# Altium schematic sheet 19 PCIE.SchDoc: CM4 IO
size 297 x 209 mm; Page Create Date: March  8, 1995; Page Number: 19; Page Size: A4; Comment: radxa_1010; Page Count: 19; RevCode: V1.10; Doc: 19 PCIE; DsnPath: D:\WMS\黄工\[RC126]CM4_IO_V1.10\[RC126]_V1.10\CM4 IO_V1.10.DSN; SchematicName: CM4 IO V1.10; PageName: 19 PCIE; PageSize: A4; TopSchematic: True
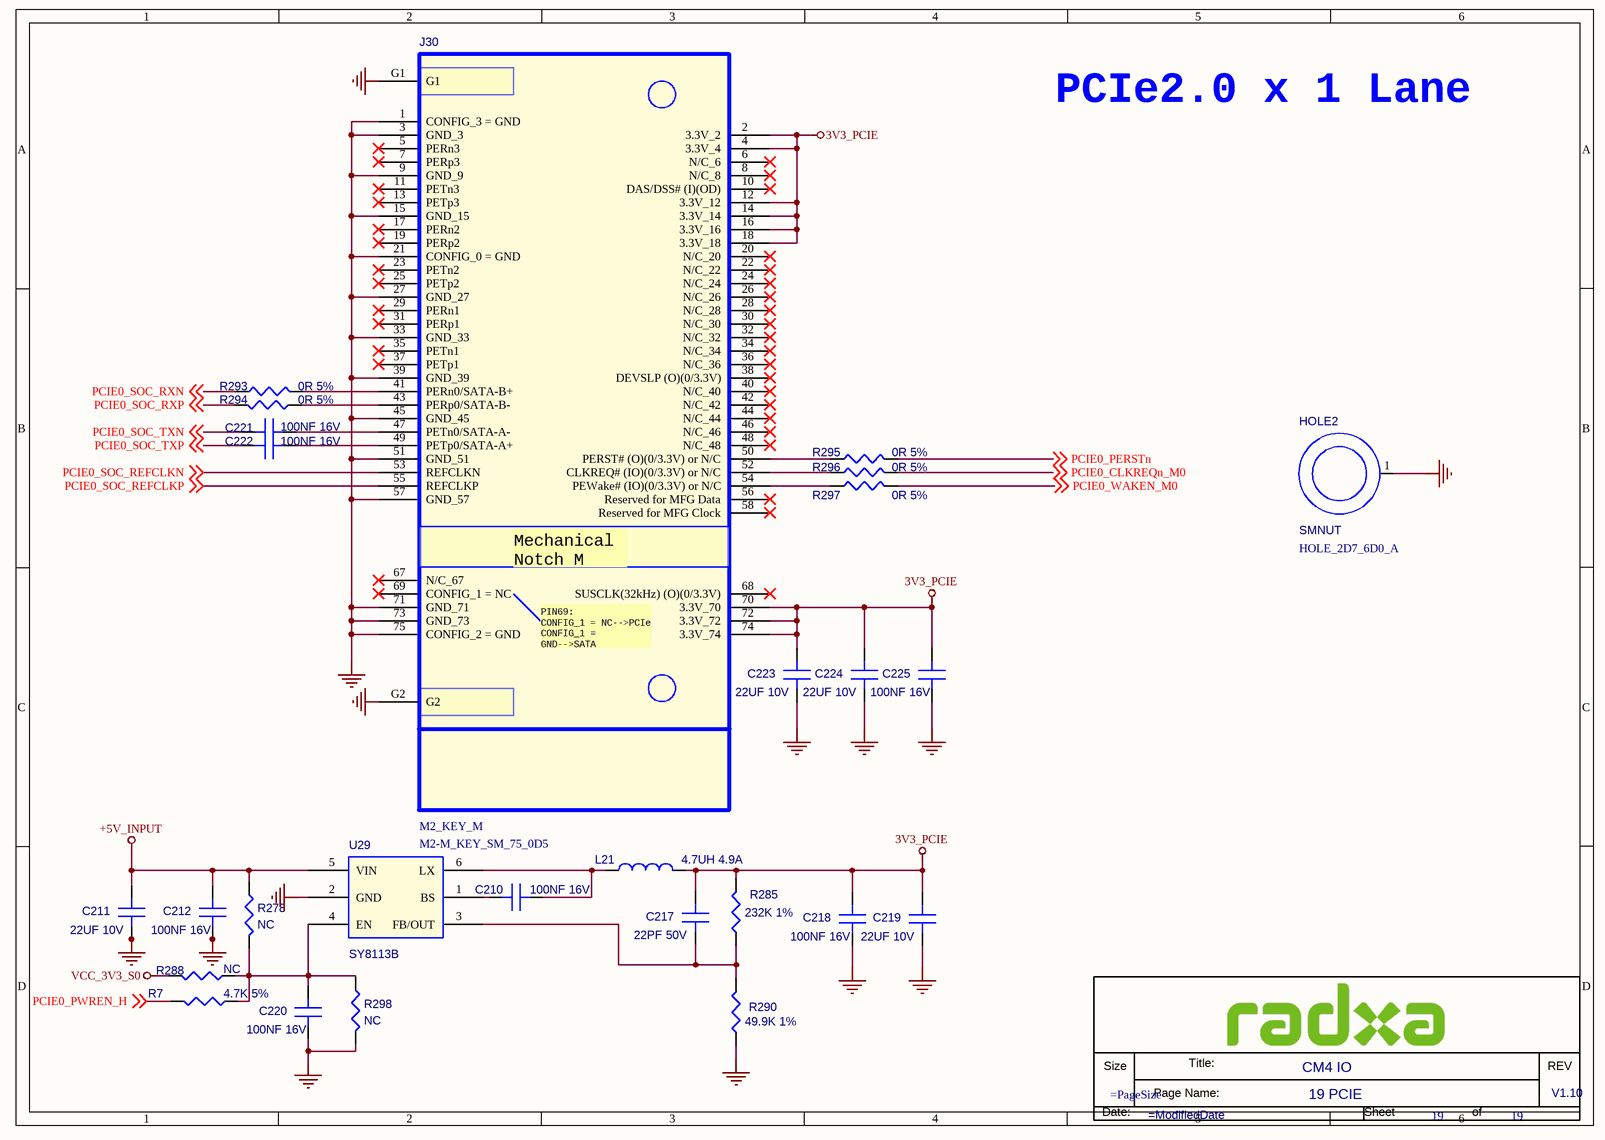
[diagram p0: 19 PCIE.SchDoc]

## Parts
*  Doc: 19 PCIE  RevCode: V1.10  Title: CM4 IO  Page Number: 19  (hidden comment: radxa_1010)  (graphical)
C210  100NF 16V  [C0201]
C211  22UF 10V  [C0603]
C212  100NF 16V  [C0201]
C217  22PF 50V  [C0201]
C218  100NF 16V  [C0201]
C219  22UF 10V  [C0603]
C220  100NF 16V  [C0201]
C221  100NF 16V  [C0201]
C222  100NF 16V  [C0201]
C223  22UF 10V  [C0603]
C224  22UF 10V  [C0603]
C225  100NF 16V  [C0201]
HOLE2  SMNUT  [HOLE_2D7_6D0_A]
J30  M2_KEY_M  [M2-M_KEY_SM_75_0D5]
L21  4.7UH 4.9A  [L_4020]
R7  4.7K 5%  [R0402]
R278  NC  [R0402]
R285  232K 1%  [R0402]
R288  NC  [R0402]
R290  49.9K 1%  [R0402]
R293  0R 5%  [R0402]
R294  0R 5%  [R0402]
R295  0R 5%  [R0402]
R296  0R 5%  [R0402]
R297  0R 5%  [R0402]
R298  NC  [R0402]
U29  SY8113B  [SOT23_6]

## Nets
3V3_PCIE: C217.1(A) C218.1(A) C219.1(A) C223.1(A) C224.1(A) C225.1(A) J30.2(3.3V_2) J30.4(3.3V_4) J30.12(3.3V_12) J30.14(3.3V_14) J30.16(3.3V_16) J30.18(3.3V_18) J30.70(3.3V_70) J30.72(3.3V_72) J30.74(3.3V_74) L21.2 R285.1
+5V_INPUT: C211.1(A) C212.1(A) R278.2 U29.5(VIN)
GND: C211.2(B) C212.2(B) C218.2(B) C219.2(B) C220.2(B) C223.2(B) C224.2(B) C225.2(B) HOLE2.1 J30.1(CONFIG_3_=_GND) J30.3(GND_3) J30.9(GND_9) J30.15(GND_15) J30.21(CONFIG_0_=_GND) J30.27(GND_27) J30.33(GND_33) J30.39(GND_39) J30.45(GND_45) J30.51(GND_51) J30.57(GND_57) J30.71(GND_71) J30.73(GND_73) J30.75(CONFIG_2_=_GND) J30.G1 J30.G2 R290.2 R298.1 U29.2(GND)
VCC_3V3_S0: R288.1
PCIE0_CLKREQn_M0: R296.2 ; off-sheet PCIE0_CLKREQn_M0
PCIE0_PERSTn: R295.2 ; off-sheet PCIE0_PERSTn
PCIE0_PWREN_H: R7.1 ; off-sheet PCIE0_PWREN_H
PCIE0_SOC_REFCLKN: J30.53(REFCLKN) ; off-sheet PCIE0_SOC_REFCLKN
PCIE0_SOC_REFCLKP: J30.55(REFCLKP) ; off-sheet PCIE0_SOC_REFCLKP
PCIE0_SOC_RXN: R293.1 ; off-sheet PCIE0_SOC_RXN
PCIE0_SOC_RXP: R294.1 ; off-sheet PCIE0_SOC_RXP
PCIE0_SOC_TXN: C221.1(A) ; off-sheet PCIE0_SOC_TXN
PCIE0_SOC_TXP: C222.1(A) ; off-sheet PCIE0_SOC_TXP
PCIE0_WAKEN_M0: R297.2 ; off-sheet PCIE0_WAKEN_M0
NetC210_1: C210.1(A) U29.1(BS)
NetC210_2: C210.2(B) L21.1 U29.6(LX)
NetC217_2: C217.2(B) R285.2 R290.1 U29.3(FB/OUT)
NetC220_1: C220.1(A) R7.2 R278.1 R288.2 R298.2 U29.4(EN)
NetC221_2: C221.2(B) J30.47(PETn0/SATA-A-)
NetC222_2: C222.2(B) J30.49(PETp0/SATA-A+)
NetJ30_41: J30.41(PERn0/SATA-B+) R293.2
NetJ30_43: J30.43(PERp0/SATA-B-) R294.2
NetJ30_50: J30.50(PERST#_(O)(0/3.3V)_or_N/C) R295.1
NetJ30_52: J30.52(CLKREQ#_(IO)(0/3.3V)_or_N/C) R296.1
NetJ30_54: J30.54(PEWake#_(IO)(0/3.3V)_or_N/C) R297.1

Not connected (* = marked no-connect by the designer): J30 5(PERn3)* 6(N/C_6)* 7(PERp3)* 8(N/C_8)* 10(DAS/DSS#_(I)(OD))* 11(PETn3)* 13(PETp3)* 17(PERn2)* 19(PERp2)* 20(N/C_20)* 22(N/C_22)* 23(PETn2)* 24(N/C_24)* 25(PETp2)* 26(N/C_26)* 28(N/C_28)* 29(PERn1)* 30(N/C_30)* 31(PERp1)* 32(N/C_32)* 34(N/C_34)* 35(PETn1)* 36(N/C_36)* 37(PETp1)* 38(DEVSLP_(O)(0/3.3V))* 40(N/C_40)* 42(N/C_42)* 44(N/C_44)* 46(N/C_46)* 48(N/C_48)* 56(Reserved_for_MFG_Data)* 58(Reserved_for_MFG_Clock)* 67(N/C_67)* 68(SUSCLK(32kHz)_(O)(0/3.3V))* 69(CONFIG_1_=_NC)*

## Notes on the sheet
- PCIe2.0 x 1 Lane
- (in symbol M2_KEY_M) Mechanical / Notch M; PIN69: / CONFIG_1 = NC-->PCIe / CONFIG_1 = / GND-->SATA
- (in symbol radxa_1010) Size; Title:; REV; Page Name:; Date:; Sheet; of

## Library data of the parts
C210 = C: SMD  0201  100NF  16V  X5R  ±20%  ROHS; PARTS: 1; Part Reference: C210; Part Number: A1C01.00099; OriginalSymbolOrigin: (0,30); PKG_TYPE: CAP2-100-250; LEVEL: STD; PINSWAP: (A,B); Preferred: 6715f349cd0bc5; Value: 100NF 16V; Part Type: 陶瓷电容
C211 = C: SMD  0603  22UF  10V  X5R  ±10%  ROHS; PARTS: 1; Part Reference: C211; Part Number: A1C01.00296; OriginalSymbolOrigin: (0,30); PKG_TYPE: CAP2-100-250; LEVEL: STD; PINSWAP: (A,B); Value: 22UF 10V; PCB Footprint: C0603; Part Type: 陶瓷电容
C212 = C: SMD  0201  100NF  16V  X5R  ±20%  ROHS; PARTS: 1; Part Reference: C212; Part Number: A1C01.00099; OriginalSymbolOrigin: (0,30); PKG_TYPE: CAP2-100-250; LEVEL: STD; PINSWAP: (A,B); Preferred: 6715f349cd0bc5; Value: 100NF 16V; Part Type: 陶瓷电容
C217 = C: SMD  0201  22PF  50V  NPO  ±5%  ROHS; PARTS: 1; Part Reference: C217; Part Number: A1C01.00021; OriginalSymbolOrigin: (0,30); PKG_TYPE: CAP2-100-250; LEVEL: STD; PINSWAP: (A,B); Value: 22PF 50V; PCB Footprint: C0201; Part Type: 陶瓷电容
C218 = C: SMD  0201  100NF  16V  X5R  ±20%  ROHS; PARTS: 1; Part Reference: C218; Part Number: A1C01.00099; OriginalSymbolOrigin: (0,30); PKG_TYPE: CAP2-100-250; LEVEL: STD; PINSWAP: (A,B); Preferred: 6715f349cd0bc5; Value: 100NF 16V; Part Type: 陶瓷电容
C219 = C: SMD  0603  22UF  10V  X5R  ±10%  ROHS; PARTS: 1; Part Reference: C219; Part Number: A1C01.00296; OriginalSymbolOrigin: (0,30); PKG_TYPE: CAP2-100-250; LEVEL: STD; PINSWAP: (A,B); Value: 22UF 10V; PCB Footprint: C0603; Part Type: 陶瓷电容
C220 = C: SMD  0201  100NF  16V  X5R  ±20%  ROHS; PARTS: 1; Part Reference: C220; Part Number: A1C01.00099; OriginalSymbolOrigin: (0,30); PKG_TYPE: CAP2-100-250; LEVEL: STD; PINSWAP: (A,B); Preferred: 6715f349cd0bc5; Value: 100NF 16V; Part Type: 陶瓷电容
C221 = C: SMD  0201  100NF  16V  X5R  ±20%  ROHS; PARTS: 1; Part Reference: C221; Part Number: A1C01.00099; OriginalSymbolOrigin: (0,30); PKG_TYPE: CAP2-100-250; LEVEL: STD; PINSWAP: (A,B); Preferred: 6715f349cd0bc5; Value: 100NF 16V; Part Type: 陶瓷电容
C222 = C: SMD  0201  100NF  16V  X5R  ±20%  ROHS; PARTS: 1; Part Reference: C222; Part Number: A1C01.00099; OriginalSymbolOrigin: (0,30); PKG_TYPE: CAP2-100-250; LEVEL: STD; PINSWAP: (A,B); Preferred: 6715f349cd0bc5; Value: 100NF 16V; Part Type: 陶瓷电容
C223 = C: SMD  0603  22UF  10V  X5R  ±10%  ROHS; PARTS: 1; Part Reference: C223; Part Number: A1C01.00296; OriginalSymbolOrigin: (0,30); PKG_TYPE: CAP2-100-250; LEVEL: STD; PINSWAP: (A,B); Value: 22UF 10V; PCB Footprint: C0603; Part Type: 陶瓷电容
C224 = C: SMD  0603  22UF  10V  X5R  ±10%  ROHS; PARTS: 1; Part Reference: C224; Part Number: A1C01.00296; OriginalSymbolOrigin: (0,30); PKG_TYPE: CAP2-100-250; LEVEL: STD; PINSWAP: (A,B); Value: 22UF 10V; PCB Footprint: C0603; Part Type: 陶瓷电容
C225 = C: SMD  0201  100NF  16V  X5R  ±20%  ROHS; PARTS: 1; Part Reference: C225; Part Number: A1C01.00099; OriginalSymbolOrigin: (0,30); PKG_TYPE: CAP2-100-250; LEVEL: STD; PINSWAP: (A,B); Preferred: 6715f349cd0bc5; Value: 100NF 16V; Part Type: 陶瓷电容
HOLE2 = SMNUT: SMD  编带  M2  通孔  一端?5mm  高6.6mm  另一端?2.5mm  高1.5mm  总高8.8mm  (带定位台阶φ2.5mm 高度0.7mm 贴高温胶纸)  适配H8.5高M.2座  铜  镀锡  DDSMT20241011288  ROHS; Part Reference: HOLE2; Part Number: A1S01.00008; Temp Coeff: -40℃ to +150℃; Preferred: 6715f349cd0bc5; Value: SMNUT; Part Type: 表贴螺母; PCB Footprint: HOLE_2D7_6D0_A
J30 = M2_KEY_M: SMD  母座  75PIN  180度  0.5mm脚距  M.2  M KEY  H8.5  黑色  ROHS; Part Reference: J30; Part Number: A1J01.00045; Parameter: 连接器-比派-封装 M2_KEY_M; Value: M2_KEY_M; Part Type: 连接座; PCB Footprint: M2-M_KEY_SM_75_0D5
L21 = L: SMD  带屏蔽  4*4*2mm  4.7UH  4.9A  ±20%  RXWHJ4020-4R7MT  ROHS; Part Reference: L21; Part Number: A1L01.00026; PCB Footprint: L_4020; Value: 4.7UH 4.9A; Part Type: 贴片功率电感
R7 = R: SMD  0201  4.7K  1/20W  ±5%  ROHS; Part Reference: R7; Part Number: A1R01.00014; PCB Footprint: R0201; Preferred: 6715f349cd0bc5; Temp Coeff: -55℃ to +125℃; Value: 4.7K 5%; Part Type: 贴片电阻
R278 = R: SMD  0201  10K  1/20W  ±5%  ROHS; Part Reference: R278; Part Number: A1R01.00012; PCB Footprint: R0201; Temp Coeff: －55℃ ~ ＋125℃; Value: NC; Part Type: 贴片电阻
R285 = R: SMD  0201  232K  1/20W  ±1%  ROHS; Part Reference: R285; Part Number: A1R01.00189; PCB Footprint: R0201; Value: 232K 1%; Part Type: 贴片电阻
R288 = R: SMD  0201  10K  1/20W  ±5%  ROHS; Part Reference: R288; Part Number: A1R01.00012; PCB Footprint: R0201; Temp Coeff: －55℃ ~ ＋125℃; Value: NC; Part Type: 贴片电阻
R290 = R: SMD  0201  49.9K  1/20W  ±1%  ROHS; Part Reference: R290; Part Number: A1R01.00207; PCB Footprint: R0201; Value: 49.9K 1%; Part Type: 贴片电阻
R293 = R: SMD  0201  0R  1/20W  ±5%  ROHS; Part Reference: R293; Part Number: A1R01.00027; PCB Footprint: R0201; Temp Coeff: －55℃ ~ ＋125℃; Value: 0R 5%; Part Type: 贴片电阻
R294 = R: SMD  0201  0R  1/20W  ±5%  ROHS; Part Reference: R294; Part Number: A1R01.00027; PCB Footprint: R0201; Temp Coeff: －55℃ ~ ＋125℃; Value: 0R 5%; Part Type: 贴片电阻
R295 = R: SMD  0201  0R  1/20W  ±5%  ROHS; Part Reference: R295; Part Number: A1R01.00027; PCB Footprint: R0201; Temp Coeff: －55℃ ~ ＋125℃; Value: 0R 5%; Part Type: 贴片电阻
R296 = R: SMD  0201  0R  1/20W  ±5%  ROHS; Part Reference: R296; Part Number: A1R01.00027; PCB Footprint: R0201; Temp Coeff: －55℃ ~ ＋125℃; Value: 0R 5%; Part Type: 贴片电阻
R297 = R: SMD  0201  0R  1/20W  ±5%  ROHS; Part Reference: R297; Part Number: A1R01.00027; PCB Footprint: R0201; Temp Coeff: －55℃ ~ ＋125℃; Value: 0R 5%; Part Type: 贴片电阻
R298 = R: SMD  0201  10K  1/20W  ±5%  ROHS; Part Reference: R298; Part Number: A1R01.00012; PCB Footprint: R0201; Temp Coeff: －55℃ ~ ＋125℃; Value: NC; Part Type: 贴片电阻
U29 = SY8113B: SMD  DCDC  SY8113BADC  SOT23-6  silergy(矽力杰)  ROHS; Part Reference: U29; Part Number: A1I01.00093; PCB Footprint: SOT23_6; Value: SY8113B; Part Type: 集成电路/模块
* = radxa_1010: Page Create Date: March  8, 1995; Page Size: =PageSize; Page Count: 19; Page Modify Date: =ModifiedDate